# Altium schematic sheet CSU8RP1185D+CS1239标准公版原理图额温枪-V2.0.SchDoc
size A3; PageSetup: Record=PageOptions|CenterHorizontal=True|CenterVertical=True|PrintScale=0.73|XCorrection=1.00|YCorrection=1.00|PrintKind=2|BorderSize=5000000|LeftOffset=0|BottomOffset=0|Orientation=2|PaperLength=1000|PaperWidth=1000|Scale=100|PaperSource=7|PrintQuality=-4|MediaType=1|DitherType=10|PaperKind=A4|PrintScaleMode=1
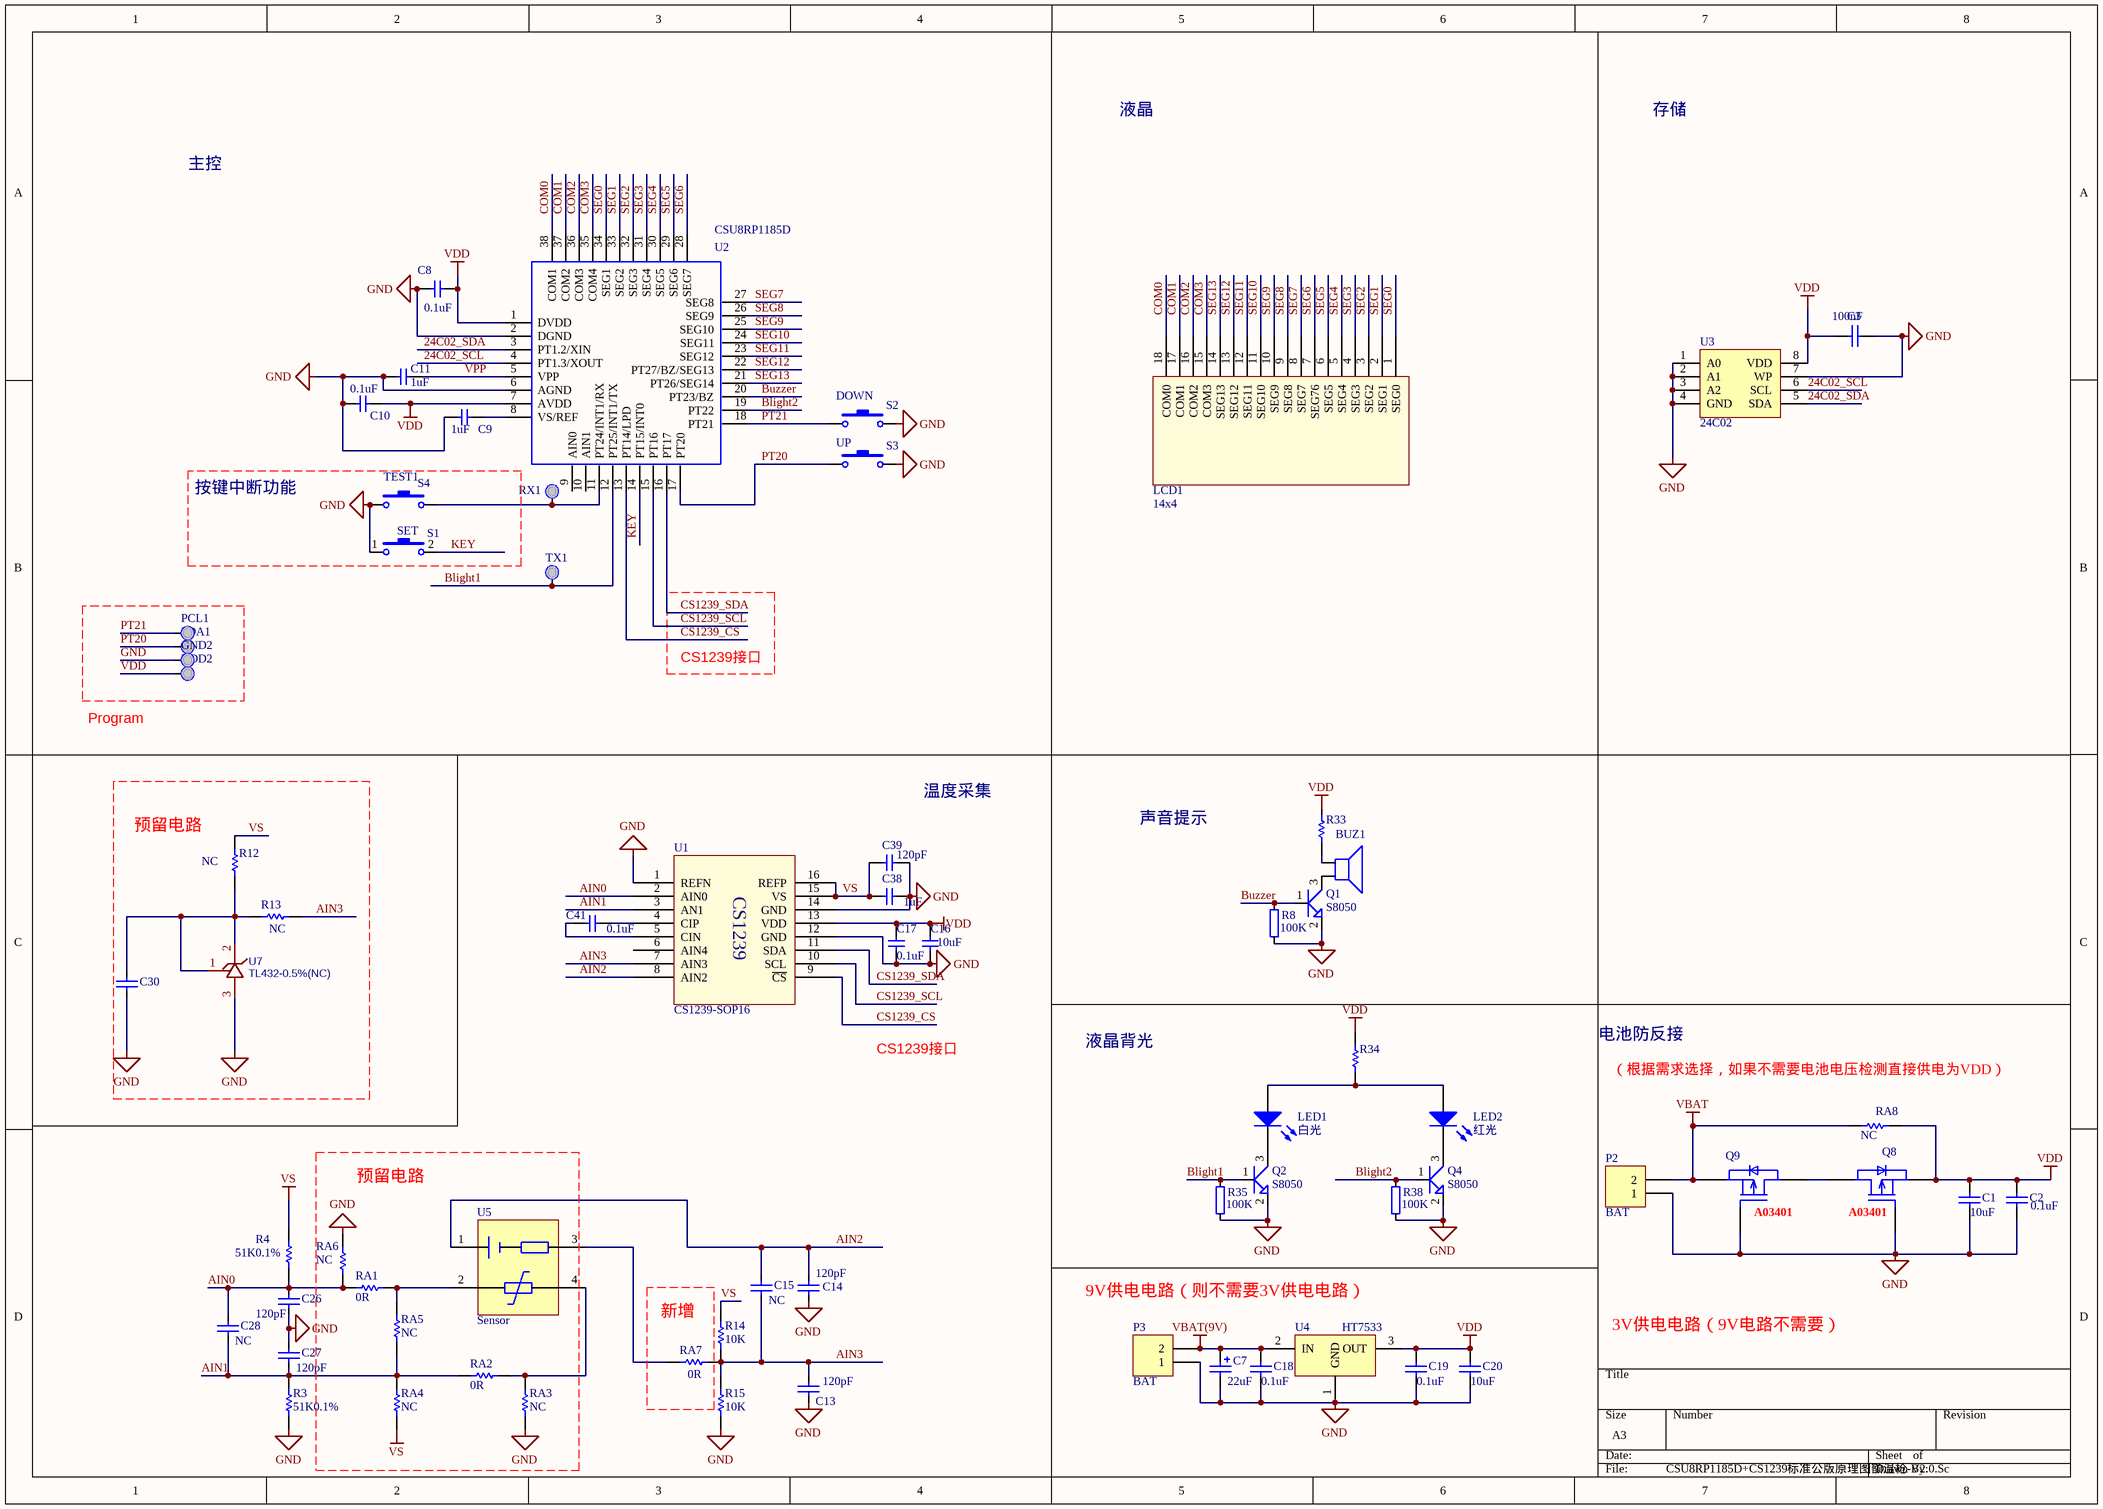
[diagram p0: CSU8RP1185D+CS1239标准公版原理图额温枪-V2.0.SchDoc]

## Parts
BUZ1  BUZZER  [BUZS9.5*6]  (value not drawn)
C1  10uF  [C0603E]
C2  0.1uF  [C0603E]
C3  100nF  [C0603E]
C7  22uF  [C3528]
C8  0.1uF  [C0603E]
C9  1uF  [C0402]
C10  0.1uF  [C0402]
C11  1uF  [C0402]
C13  120pF  [C0603E]
C14  120pF  [C0603E]
C15  NC  [C0603E]
C16  10uF  [C0603E]
C17  0.1uF  [C0603E]
C18  0.1uF  [C0603E]
C19  0.1uF  [C0603E]
C20  10uF  [C0603E]
C26  120pF  [C0603E]
C27  120pF  [C0603E]
C28  NC  [C0603E]
C30  NC  [C1206]  (value not drawn)
C38  1uF  [C0603E]
C39  120pF  [C0603E]
C41  0.1uF  [C0603E]
GND2  (no value)  [TEST-SMD 1.5]
LCD1  14x4  [LCD_13X4_TZL3304_体温]
LED1  白光  [YTSG-3326E-1PRGF03B]
LED2  红光  [0603D$2F$3]
P2  BAT  [HDR1X2]
P3  BAT  [HDR1X2]
PCL1  (no value)  [TEST-SMD 1.5]
PDA1  (no value)  [TEST-SMD 1.5]
Q1  S8050  [SOT-23S]
Q2  S8050  [SOT-23S]
Q4  S8050  [SOT-23S]
Q8  A03401  [SOT-23-GSD]
Q9  A03401  [SOT-23-GSD]
R3  51K0.1%  [R0603E]
R4  51K0.1%  [R0603E]
R8  100K  [0603]
R12  NC  [AXIAL-0.3]
R13  NC  [AXIAL-0.3]
R14  10K  [AXIAL-0.3]
R15  10K  [AXIAL-0.3]
R33  (no value)  [R0603E]
R34  (no value)  [R0603E]
R35  100K  [0603]
R38  100K  [0603]
RA1  0R  [R0603E]
RA2  0R  [R0603E]
RA3  NC  [R0603E]
RA4  NC  [R0603E]
RA5  NC  [R0603E]
RA6  NC  [R0603E]
RA7  0R  [R0603E]
RA8  NC  [R0603E]
RX1  (no value)  [TEST-SMD 1.5]
S1  SET  [SW-4X6_SMD]
S2  DOWN  [SW-4X6_SMD]
S3  UP  [SW-4X6_SMD]
S4  TEST1  [SW-4X6]
TX1  (no value)  [TEST-SMD 1.5]
U1  CS1239-SOP16
U2  CSU8RP1185D  [CSU8RP1186B-BD]
U3  24C02  [SMD8]
U4  HT7533
U5  Sensor  [OTP-53]
U7  TL432-0.5%(NC)  [SOT-23-3_L2.9-W1.3-P1.90-LS2.4-BR]
VDD2  (no value)  [TEST-SMD 1.5]

## Blocks framed on the sheet
预留电路: C30 R12 R13 U7
预留电路: RA1-RA6 U5
新增: RA7

## Nets
GND: C1.2 C2.2 C3.2 C7.2 C8.1 C9.1 C10.2 C11.1 C13.2 C14.2 C16.1 C17.2 C18.2 C19.2 C20.2 C26.1 C27.2 C30.1 C38.2 C39.2 GND2.1 P2.1 P3.1 Q1.2 Q2.2 Q4.2 Q8.G Q9.G R3.2 R8.2 R15.1 R35.2 R38.2 RA3.1 RA6.2 S1.1 S2.2 S3.2 S4.1 U1.1(REFN) U1.12(GND) U1.14(GND) U2.2(DGND) U2.6(AGND) U3.1(A0) U3.2(A1) U3.3(A2) U3.4(GND) U3.7(WP) U4.1(GND) U7.3(A)
VBAT: P2.2 Q9.S RA8.2
VBAT(9V): C7.1 C18.1 P3.2 U4.2(IN)
VDD: C1.1 C2.1 C3.1 C8.2 C10.1 C16.2 C17.1 C19.1 C20.1 Q8.S R34.1 RA8.1 U1.13(VDD) U2.1(DVDD) U2.7(AVDD) U3.8(VDD) U4.3(OUT) VDD2.1
VS: C38.1 C39.1 R4.1 R12.1 R14.2 RA4.1 U1.15(VS) U1.16(REFP)
24C02_SCL: U2.4(PT1.3/XOUT) U3.6(SCL)
24C02_SDA: U2.3(PT1.2/XIN) U3.5(SDA)
AIN0: C26.2 C28.2 R4.2 RA1.1 RA6.1 U1.2(AIN0)
AIN1: C27.1 C28.1 R3.1 RA2.1 RA4.2 RA5.1 U1.3(AN1)
AIN2: C14.1 C15.2 U1.8(AIN2) U5.1
AIN3: C13.1 C15.1 R13.2 R14.1 R15.2 RA7.1 U1.7(AIN3)
Blight1: Q2.1 R35.1 TX1.1 U2.12(PT25/INT1/TX)
Blight2: Q4.1 R38.1 U2.19(PT22)
Buzzer: Q1.1 R8.1 U2.20(PT23/BZ)
COM0: LCD1.18(COM0) U2.38(COM1)
COM1: LCD1.17(COM1) U2.37(COM2)
COM2: LCD1.16(COM2) U2.36(COM3)
COM3: LCD1.15(COM3) U2.35(COM4)
CS1239_CS: U1.9(~{CS}) U2.13(PT14/LPD)
CS1239_SCL: U1.10(SCL) U2.15(PT16)
CS1239_SDA: U1.11(SDA) U2.16(PT17)
KEY: S1.2 U2.14(PT15/INT0)
PT20: PDA1.1 S3.1 U2.17(PT20)
PT21: PCL1.1 S2.1 U2.18(PT21)
SEG0: LCD1.1(SEG0) U2.34(SEG1)
SEG1: LCD1.2(SEG1) U2.33(SEG2)
SEG2: LCD1.3(SEG2) U2.32(SEG3)
SEG3: LCD1.4(SEG3) U2.31(SEG4)
SEG4: LCD1.5(SEG4) U2.30(SEG5)
SEG5: LCD1.6(SEG5) U2.29(SEG6)
SEG6: LCD1.7(SEG76) U2.28(SEG7)
SEG7: LCD1.8(SEG7) U2.27(SEG8)
SEG8: LCD1.9(SEG8) U2.26(SEG9)
SEG9: LCD1.10(SEG9) U2.25(SEG10)
SEG10: LCD1.11(SEG10) U2.24(SEG11)
SEG11: LCD1.12(SEG11) U2.23(SEG12)
SEG12: LCD1.13(SEG12) U2.22(PT27/BZ/SEG13)
SEG13: LCD1.14(SEG13) U2.21(PT26/SEG14)
VPP: C11.2 U2.5(VPP)
NetBUZ1_1: BUZ1.1(+) R33.2
NetBUZ1_2: BUZ1.2(-) Q1.3
NetC9_2: C9.2 U2.8(VS/REF)
NetC30_2: C30.2 R12.2 R13.1 U7.1(R) U7.2(K)
NetC41_1: C41.1 U1.4(CIP)
NetC41_2: C41.2 U1.5(CIN)
NetLED1_1: LED1.1(A) LED2.1(A) R34.2
NetLED1_2: LED1.2(K) Q2.3
NetLED2_2: LED2.2(K) Q4.3
NetQ8_D: Q8.D Q9.D
NetRA1_2: RA1.2 RA5.2 U5.2
NetRA2_2: RA2.2 RA3.2 U5.4
NetRA7_2: RA7.2 U5.3
NetRX1_1: RX1.1 S4.2 U2.11(PT24/INT1/RX)

Not connected (* = marked no-connect by the designer): R33 1; U1 6(AIN4); U2 9(AIN0) 10(AIN1)

## Notes on the sheet
- 主控
- 液晶
- 存储
- 按键中断功能
- Program
- CS1239接口
- 温度采集
- 声音提示
- 液晶背光
- 电池防反接
- （根据需求选择，如果不需要电池电压检测直接供电为VDD）
- 9V供电电路（则不需要3V供电电路）
- 3V供电电路（9V电路不需要）
- Labels drawn without touching a wire or pin: VDD
- (in symbol Component_1) CS1239

## Library data of the parts
BUZ1 = Speaker
C1-C3 C18-C20 = Cap Semi: Capacitor (Semiconductor SIM Model); Published: 8-Jun-2000; LatestRevisionDate: 29-May-2009; LatestRevisionNote: IPC-7351 Footprint Added.; PackageReference: C1206; Publisher: Altium Limited; PackageDescription: Chip Capacitor
  C1 C20: Value: 10uF
  C2 C18 C19: Value: 0.1uF
  C3: Value: 100nF
C7 = Cap Pol2: Polarized Capacitor (Axial); Value: 220UF; Published: 8-Jun-2000; LatestRevisionDate: 17-Jul-2002; LatestRevisionNote: Re-released for DXP Platform.; PackageReference: POLAR0.8; Publisher: Altium Limited; PackageDescription: Polarized Capacitor; 2 Leads
C8-C11 C16 C17 C38 C39 C41 = CAP: Text Field1: 0.1; 0.1: *
C13 C14 = Cap Semi: Capacitor (Semiconductor SIM Model); Value: 47pF; Published: 8-Jun-2000; LatestRevisionDate: 29-May-2009; LatestRevisionNote: IPC-7351 Footprint Added.; PackageReference: C1206; Publisher: Altium Limited; PackageDescription: Chip Capacitor
C15 C26-C28 = Cap Semi: Capacitor (Semiconductor SIM Model); Value: 10nF; Published: 8-Jun-2000; LatestRevisionDate: 29-May-2009; LatestRevisionNote: IPC-7351 Footprint Added.; PackageReference: C1206; Publisher: Altium Limited; PackageDescription: Chip Capacitor
C30 = Cap Semi: Capacitor (Semiconductor SIM Model); Value: 100nF; Published: 8-Jun-2000; LatestRevisionDate: 29-May-2009; LatestRevisionNote: IPC-7351 Footprint Added.; PackageReference: C1206; Publisher: Altium Limited; PackageDescription: Chip Capacitor
GND2 PCL1 PDA1 RX1 TX1 VDD2 = TESTPOINT
LCD1 = Component_1_1
LED1 LED2 = LED0: Typical INFRARED GaAs LED; Published: 8-Jun-2000; LatestRevisionDate: 08-Jul-2005; LatestRevisionNote: Mech Layer 1 removed.; PackageReference: LED-0; Publisher: Altium Limited
P2 P3 = Header 2: Header, 2-Pin; LatestRevisionDate: 17-Jul-2002; LatestRevisionNote: Re-released for DXP Platform.; Publisher: Altium Limited
Q1 Q2 Q4 = NPN: NPN三极管
Q8 Q9 = MOS-P
R3 R4 R33 R34 RA1-RA8 = Res1: Resistor; Value: 10K; Published: 8-Jun-2000; LatestRevisionDate: 17-Jul-2002; LatestRevisionNote: Re-released for DXP Platform.; PackageReference: AXIAL-0.3; Publisher: Altium Limited; PackageDescription: Axial Device, Thru-Hole; 2 Leads; 0.3 in Pin Spacing
R8 R35 R38 = R: 电阻
R12 = Res1: Resistor; Value: 2k; Published: 8-Jun-2000; LatestRevisionDate: 17-Jul-2002; LatestRevisionNote: Re-released for DXP Platform.; PackageReference: AXIAL-0.3; Publisher: Altium Limited; PackageDescription: Axial Device, Thru-Hole; 2 Leads; 0.3 in Pin Spacing
R13-R15 = Res1: Resistor; Value: 5.1k; Published: 8-Jun-2000; LatestRevisionDate: 17-Jul-2002; LatestRevisionNote: Re-released for DXP Platform.; PackageReference: AXIAL-0.3; Publisher: Altium Limited; PackageDescription: Axial Device, Thru-Hole; 2 Leads; 0.3 in Pin Spacing
S1-S4 = SW-PB: Switch; Published: 24-Mar-1999; LatestRevisionDate: 17-Jul-2002; LatestRevisionNote: Re-released for DXP Platform.; Publisher: Altium Limited
U1 U4 = Component_1
U3 = Component_2
U5 = Component_4
U7 = TL432-0.5%: BOM_Manufacturer: Shenzhen Jinyu Semicon; Contributor: LCSC; BOM_Supplier: LCSC; BOM_Supplier Part: C259989; BOM_Manufacturer Part: TL432-0.5%; spicePre: U; spiceSymbolName: TL432-0.5%
U2 = CSU8RP1185D: PCB DECAL: CSU8RP1186B-BD